# EasyEDA schematic PowerSuply_Schematic_ETCautoPrikratki.json
TITLE: Sheet_1; REV: 1.0; Date: 2024-10-18; Sheet: 1/1; Drawn By: ivan.kolaric96; Company: Your Company
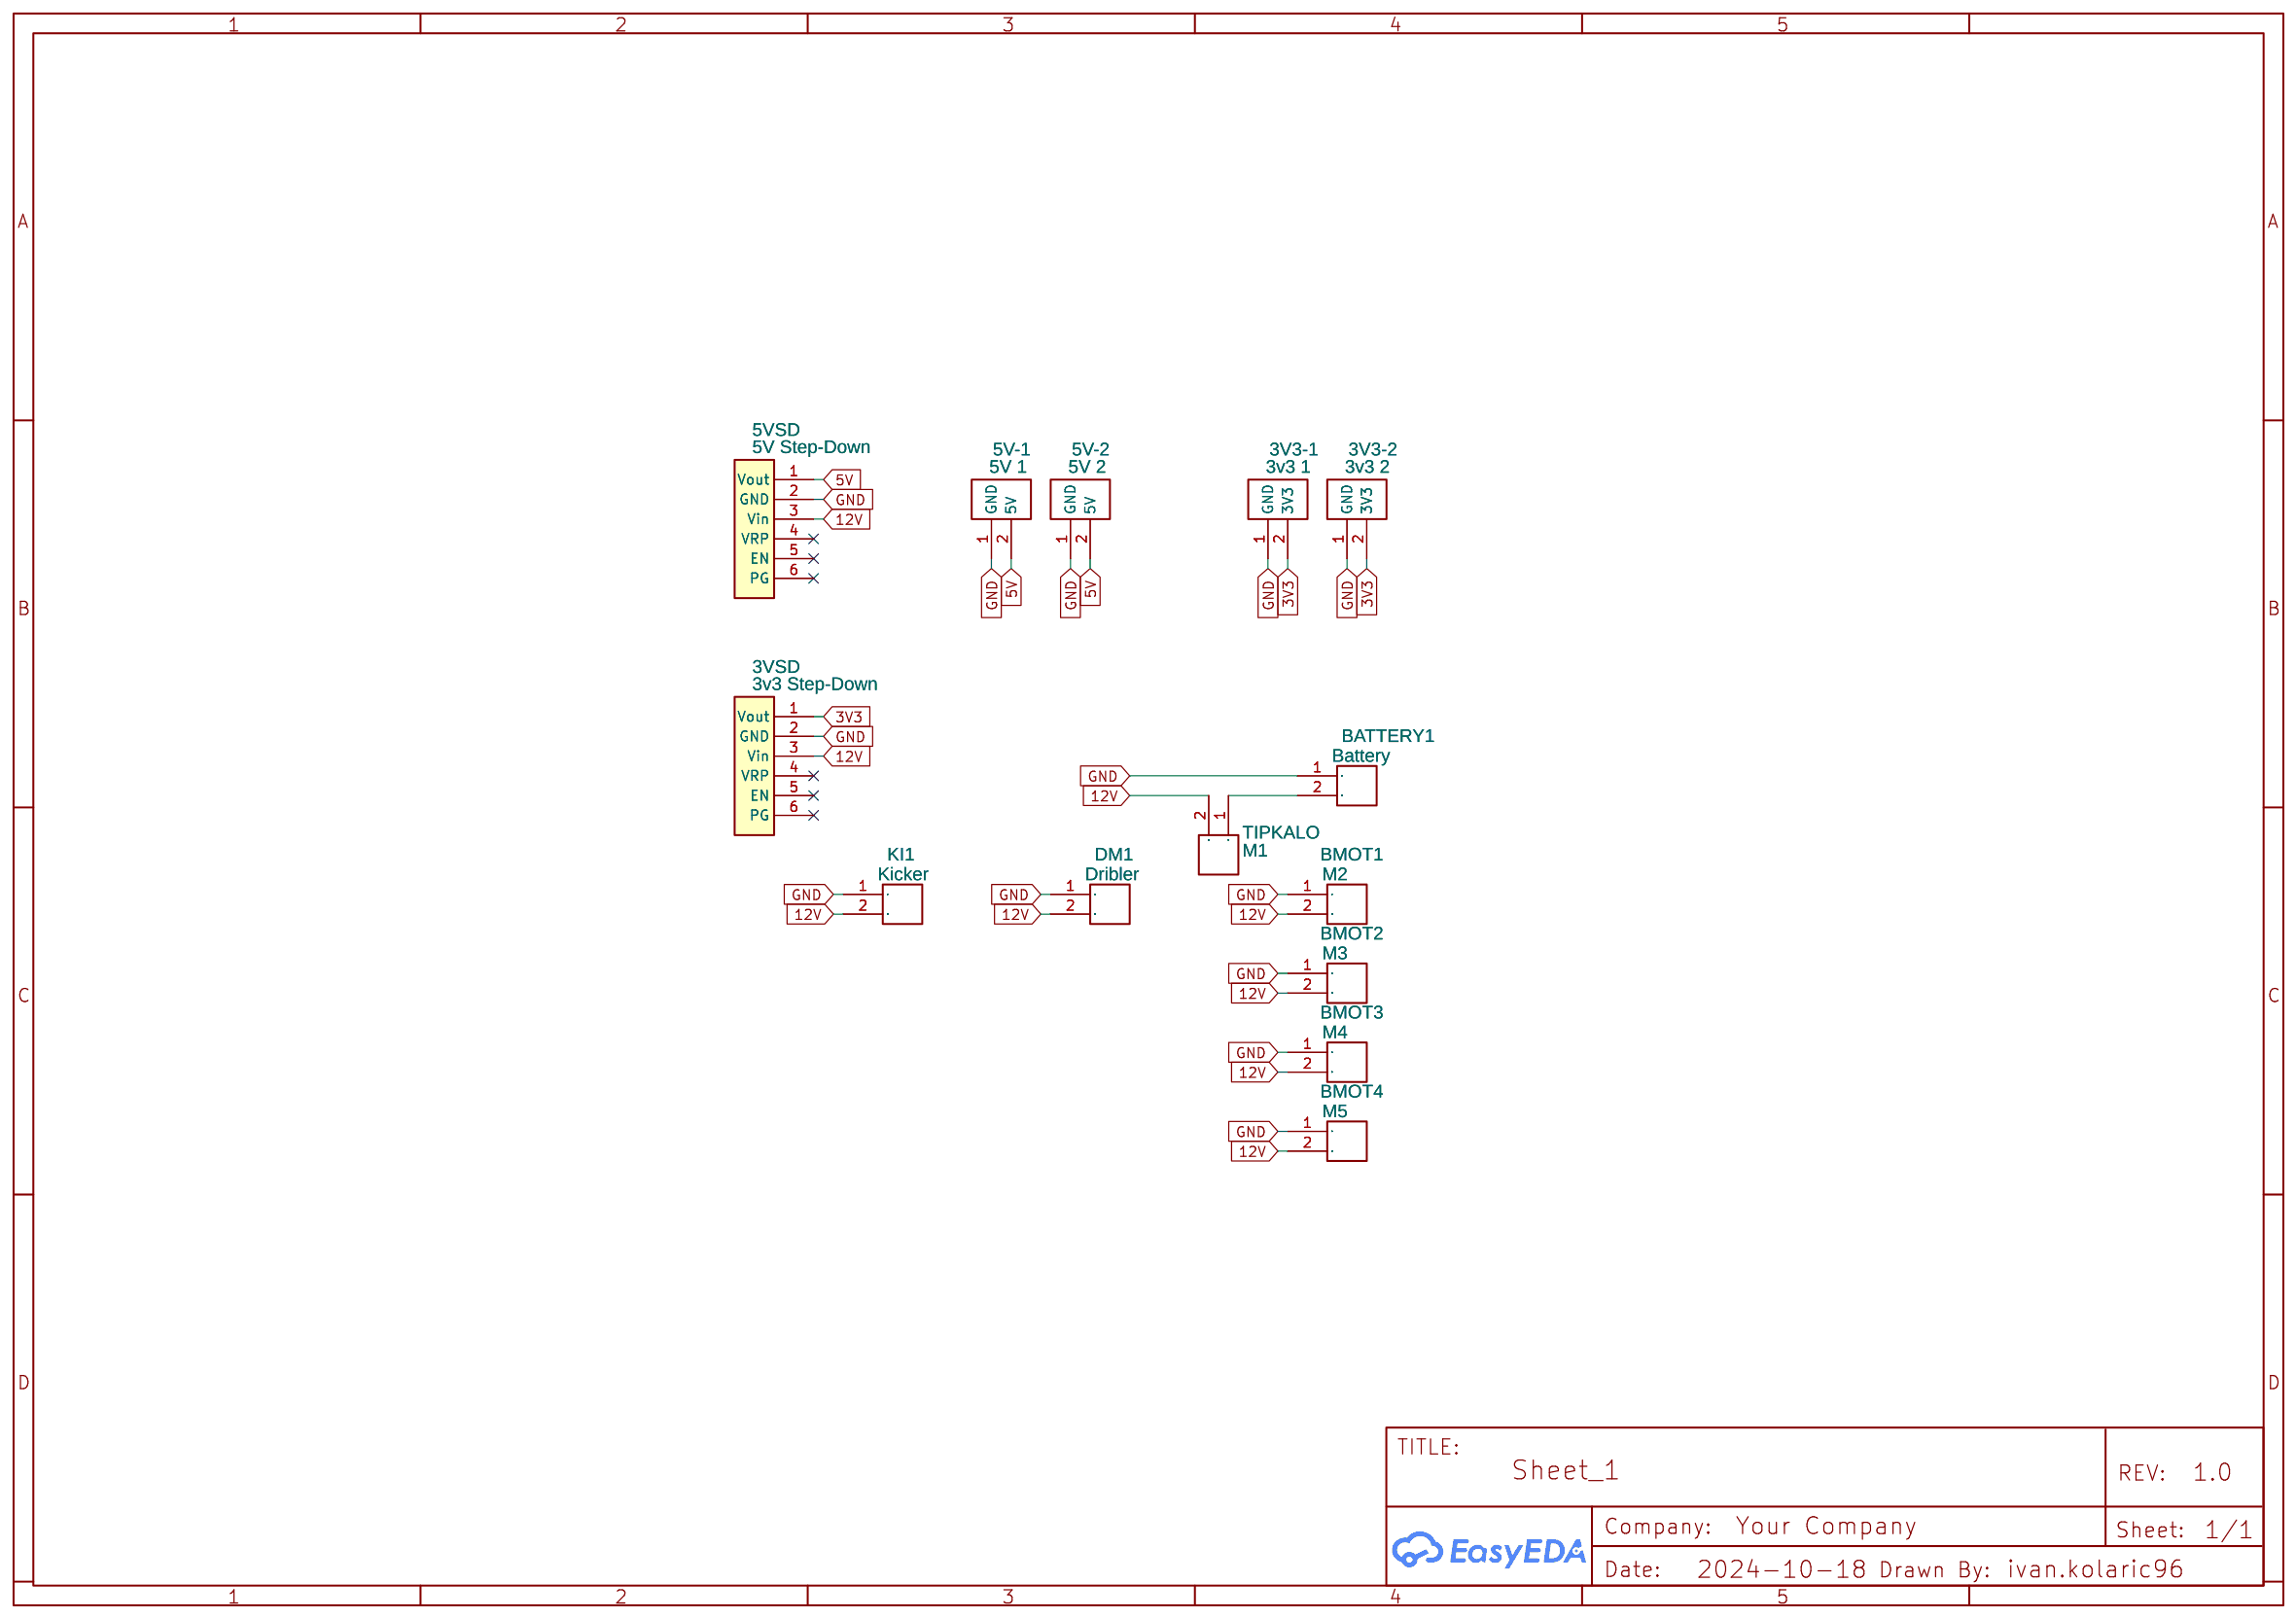
[diagram p0: schematic sheet]

## Parts
3V3-1  3v3 1  [MOLEX-KK254X2]
3V3-2  3v3 2  [MOLEX-KK254X2]
3VSD  3v3 Step-Down  [D36V50F5]
5V-1  5V 1  [MOLEX-KK254X2]
5V-2  5V 2  [MOLEX-KK254X2]
5VSD  5V Step-Down  [D36V50F5]
BATTERY1  Battery  [MOLEX KK396 2 PIN]
BMOT1  M2  [MOLEX KK396 2 PIN]
BMOT2  M3  [MOLEX KK396 2 PIN]
BMOT3  M4  [MOLEX KK396 2 PIN]
BMOT4  M5  [MOLEX KK396 2 PIN]
DM1  Dribler  [MOLEX KK396 2 PIN]
KI1  Kicker  [MOLEX KK396 2 PIN]
TIPKALO  M1  [MOLEX KK396 2 PIN]

## Library data of the parts
3V3-1 3V3-2 5V-1 5V-2 = MOLEX_KK254_2P VERT.: Manufacturer: MOLEX; Manufacturer Part: 22-11-2022; Supplier Part: 22-11-2022 MOLEX; Supplier: TME; link: https://www.tme.eu/cz/details/mx-6410-04a/signalove-konektory-raster-2-54mm/molex/22-27-2041/; Contributor: Micbelli
3VSD 5VSD = STEP-DOWN POLOLU D36V50F5: Contributor: guillaume888; sourceId: YsmgyP7pj; Supplier: GoTronic
BATTERY1 BMOT1-BMOT4 DM1 KI1 TIPKALO = Molex KKK396 2 Pin: Supplier: LiveThings; Contributor: Fratel

## Nets
3V3: 3V3-1.2(3V3) 3V3-2.2(3V3) 3VSD.1(Vout)
5V: 5V-1.2(5V) 5V-2.2(5V) 5VSD.1(Vout)
12V: 3VSD.3(Vin) 5VSD.3(Vin) BMOT1.2 BMOT2.2 BMOT3.2 BMOT4.2 DM1.2 KI1.2 TIPKALO.2
GND: 3V3-1.1(GND) 3V3-2.1(GND) 3VSD.2(GND) 5V-1.1(GND) 5V-2.1(GND) 5VSD.2(GND) BATTERY1.1 BMOT1.1 BMOT2.1 BMOT3.1 BMOT4.1 DM1.1 KI1.1
Net-(BATTERY1-2): BATTERY1.2 TIPKALO.1

Not connected (* = marked no-connect by the designer): 3VSD 4(VRP)* 5(EN)* 6(PG)*; 5VSD 4(VRP)* 5(EN)* 6(PG)*
